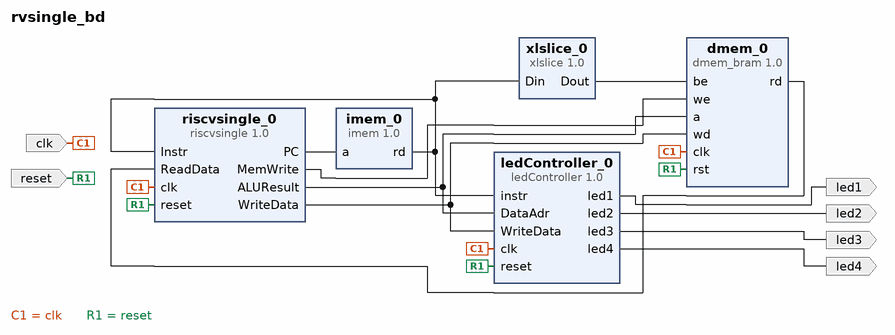
[diagram p0: block diagram of the top level]
# Vivado block design rvsingle_bd, xc7z010clg400-1, Vivado 2019.2
create_bd_design rvsingle_bd

create_bd_port -dir O led3
create_bd_port -dir O led2
create_bd_port -dir O led1
create_bd_port -dir O led4
create_bd_port -dir I -type clk clk
set_property -dict {CONFIG.FREQ_HZ 62500000 CONFIG.PHASE 0.000} [get_bd_ports clk]
create_bd_port -dir I -type rst reset
set_property -dict {CONFIG.POLARITY ACTIVE_HIGH} [get_bd_ports reset]

create_bd_cell -type ip -vlnv xilinx.com:ip:xlslice:1.0 xlslice_0
set_property -dict {CONFIG.DIN_FROM 13 CONFIG.DIN_TO 12 CONFIG.DOUT_WIDTH 2} [get_bd_cells xlslice_0]
create_bd_cell -type ip -vlnv user.org:user:riscvsingle:1.0 riscvsingle_0
create_bd_cell -type ip -vlnv user.org:user:ledController:1.0 ledController_0
create_bd_cell -type ip -vlnv user.org:user:dmem_bram:1.0 dmem_0
create_bd_cell -type ip -vlnv user.org:user:imem:1.0 imem_0

# ---- connections ----

connect_bd_net [get_bd_pins imem_0/rd] [get_bd_pins xlslice_0/Din] [get_bd_pins riscvsingle_0/Instr] [get_bd_pins ledController_0/instr]
connect_bd_net [get_bd_pins riscvsingle_0/ALUResult] [get_bd_pins ledController_0/DataAdr] [get_bd_pins dmem_0/a]
connect_bd_net [get_bd_pins riscvsingle_0/WriteData] [get_bd_pins ledController_0/WriteData] [get_bd_pins dmem_0/wd]
connect_bd_net [get_bd_pins ledController_0/led3] [get_bd_ports led3]
connect_bd_net [get_bd_pins ledController_0/led2] [get_bd_ports led2]
connect_bd_net [get_bd_pins ledController_0/led1] [get_bd_ports led1]
connect_bd_net [get_bd_pins ledController_0/led4] [get_bd_ports led4]
connect_bd_net -net clk_wiz_clk_out1 [get_bd_ports clk] [get_bd_pins riscvsingle_0/clk] [get_bd_pins ledController_0/clk] [get_bd_pins dmem_0/clk]
connect_bd_net [get_bd_ports reset] [get_bd_pins riscvsingle_0/reset] [get_bd_pins ledController_0/reset] [get_bd_pins dmem_0/rst]
connect_bd_net [get_bd_pins dmem_0/rd] [get_bd_pins riscvsingle_0/ReadData]
connect_bd_net [get_bd_pins riscvsingle_0/MemWrite] [get_bd_pins dmem_0/we]
connect_bd_net [get_bd_pins xlslice_0/Dout] [get_bd_pins dmem_0/be]
connect_bd_net [get_bd_pins riscvsingle_0/PC] [get_bd_pins imem_0/a]

validate_bd_design
save_bd_design
